# Altium schematic sheet 5F00143A MPLB-01.SchDoc
size 420 x 297 mm; Author: ALTIUM GOSTBOM2.0 KEV
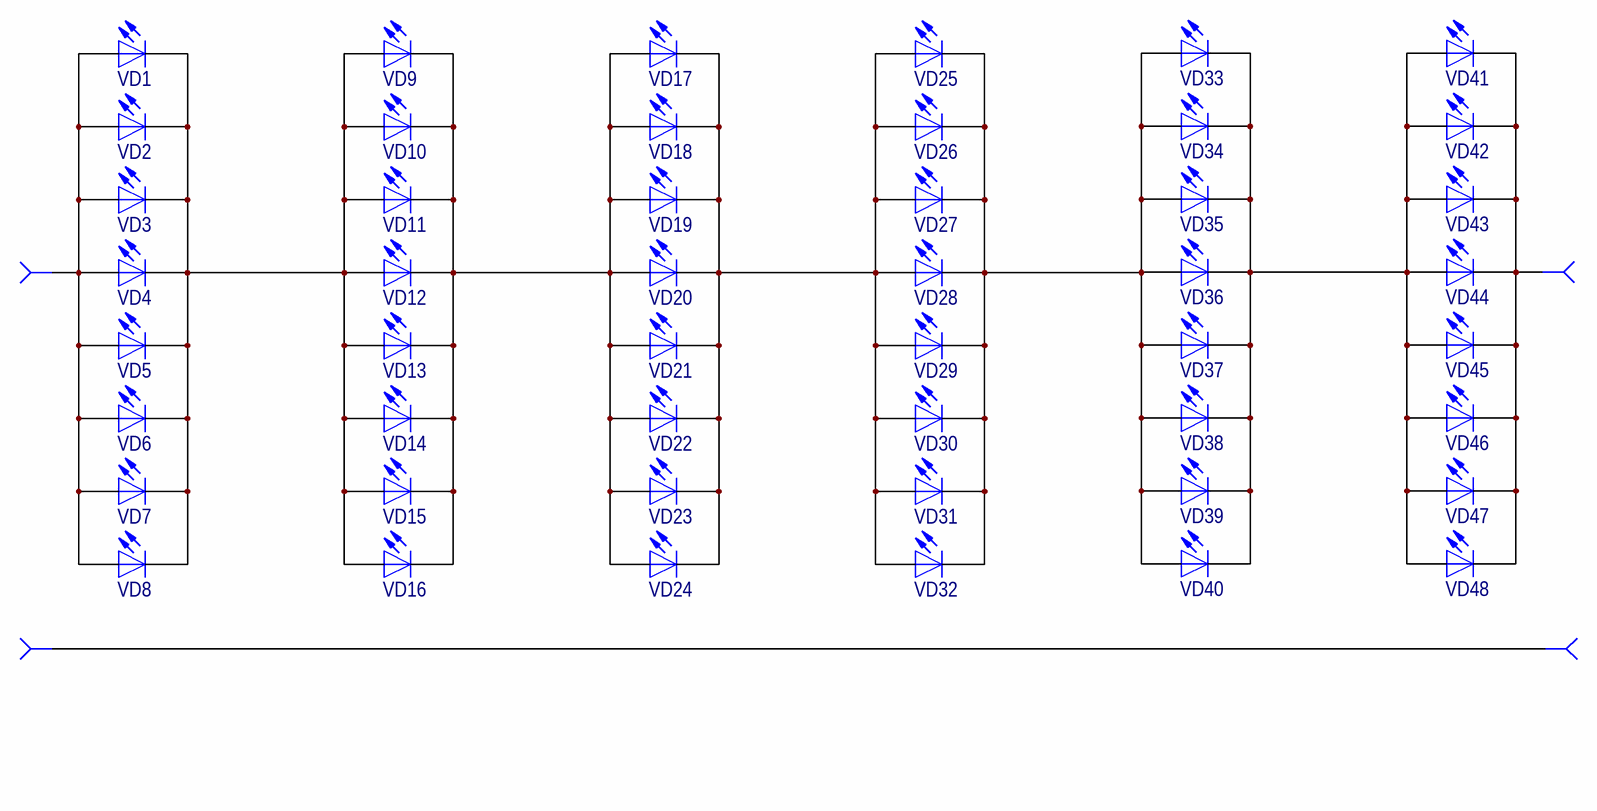
[diagram p0: 5F00143A MPLB-01.SchDoc]

## Parts
VD1  LED SMD, SPMWH1228FD5WAWMSG, White, 2700K,  Samsung  [LM281B+]  (value not drawn)
VD2  LED SMD, SPMWH1228FD5WAWMSG, White, 2700K,  Samsung  [LM281B+]  (value not drawn)
VD3  LED SMD, SPMWH1228FD5WAWMSG, White, 2700K,  Samsung  [LM281B+]  (value not drawn)
VD4  LED SMD, SPMWH1228FD5WAWMSG, White, 2700K,  Samsung  [LM281B+]  (value not drawn)
VD5  LED SMD, SPMWH1228FD5WAWMSG, White, 2700K,  Samsung  [LM281B+]  (value not drawn)
VD6  LED SMD, SPMWH1228FD5WAWMSG, White, 2700K,  Samsung  [LM281B+]  (value not drawn)
VD7  LED SMD, SPMWH1228FD5WAWMSG, White, 2700K,  Samsung  [LM281B+]  (value not drawn)
VD8  LED SMD, SPMWH1228FD5WAWMSG, White, 2700K,  Samsung  [LM281B+]  (value not drawn)
VD9  LED SMD, SPMWH1228FD5WAWMSG, White, 2700K,  Samsung  [LM281B+]  (value not drawn)
VD10  LED SMD, SPMWH1228FD5WAWMSG, White, 2700K,  Samsung  [LM281B+]  (value not drawn)
VD11  LED SMD, SPMWH1228FD5WAWMSG, White, 2700K,  Samsung  [LM281B+]  (value not drawn)
VD12  LED SMD, SPMWH1228FD5WAWMSG, White, 2700K,  Samsung  [LM281B+]  (value not drawn)
VD13  LED SMD, SPMWH1228FD5WAWMSG, White, 2700K,  Samsung  [LM281B+]  (value not drawn)
VD14  LED SMD, SPMWH1228FD5WAWMSG, White, 2700K,  Samsung  [LM281B+]  (value not drawn)
VD15  LED SMD, SPMWH1228FD5WAWMSG, White, 2700K,  Samsung  [LM281B+]  (value not drawn)
VD16  LED SMD, SPMWH1228FD5WAWMSG, White, 2700K,  Samsung  [LM281B+]  (value not drawn)
VD17  LED SMD, SPMWH1228FD5WAWMSG, White, 2700K,  Samsung  [LM281B+]  (value not drawn)
VD18  LED SMD, SPMWH1228FD5WAWMSG, White, 2700K,  Samsung  [LM281B+]  (value not drawn)
VD19  LED SMD, SPMWH1228FD5WAWMSG, White, 2700K,  Samsung  [LM281B+]  (value not drawn)
VD20  LED SMD, SPMWH1228FD5WAWMSG, White, 2700K,  Samsung  [LM281B+]  (value not drawn)
VD21  LED SMD, SPMWH1228FD5WAWMSG, White, 2700K,  Samsung  [LM281B+]  (value not drawn)
VD22  LED SMD, SPMWH1228FD5WAWMSG, White, 2700K,  Samsung  [LM281B+]  (value not drawn)
VD23  LED SMD, SPMWH1228FD5WAWMSG, White, 2700K,  Samsung  [LM281B+]  (value not drawn)
VD24  LED SMD, SPMWH1228FD5WAWMSG, White, 2700K,  Samsung  [LM281B+]  (value not drawn)
VD25  LED SMD, SPMWH1228FD5WAWMSG, White, 2700K,  Samsung  [LM281B+]  (value not drawn)
VD26  LED SMD, SPMWH1228FD5WAWMSG, White, 2700K,  Samsung  [LM281B+]  (value not drawn)
VD27  LED SMD, SPMWH1228FD5WAWMSG, White, 2700K,  Samsung  [LM281B+]  (value not drawn)
VD28  LED SMD, SPMWH1228FD5WAWMSG, White, 2700K,  Samsung  [LM281B+]  (value not drawn)
VD29  LED SMD, SPMWH1228FD5WAWMSG, White, 2700K,  Samsung  [LM281B+]  (value not drawn)
VD30  LED SMD, SPMWH1228FD5WAWMSG, White, 2700K,  Samsung  [LM281B+]  (value not drawn)
VD31  LED SMD, SPMWH1228FD5WAWMSG, White, 2700K,  Samsung  [LM281B+]  (value not drawn)
VD32  LED SMD, SPMWH1228FD5WAWMSG, White, 2700K,  Samsung  [LM281B+]  (value not drawn)
VD33  LED SMD, SPMWH1228FD5WAWMSG, White, 2700K,  Samsung  [LM281B+]  (value not drawn)
VD34  LED SMD, SPMWH1228FD5WAWMSG, White, 2700K,  Samsung  [LM281B+]  (value not drawn)
VD35  LED SMD, SPMWH1228FD5WAWMSG, White, 2700K,  Samsung  [LM281B+]  (value not drawn)
VD36  LED SMD, SPMWH1228FD5WAWMSG, White, 2700K,  Samsung  [LM281B+]  (value not drawn)
VD37  LED SMD, SPMWH1228FD5WAWMSG, White, 2700K,  Samsung  [LM281B+]  (value not drawn)
VD38  LED SMD, SPMWH1228FD5WAWMSG, White, 2700K,  Samsung  [LM281B+]  (value not drawn)
VD39  LED SMD, SPMWH1228FD5WAWMSG, White, 2700K,  Samsung  [LM281B+]  (value not drawn)
VD40  LED SMD, SPMWH1228FD5WAWMSG, White, 2700K,  Samsung  [LM281B+]  (value not drawn)
VD41  LED SMD, SPMWH1228FD5WAWMSG, White, 2700K,  Samsung  [LM281B+]  (value not drawn)
VD42  LED SMD, SPMWH1228FD5WAWMSG, White, 2700K,  Samsung  [LM281B+]  (value not drawn)
VD43  LED SMD, SPMWH1228FD5WAWMSG, White, 2700K,  Samsung  [LM281B+]  (value not drawn)
VD44  LED SMD, SPMWH1228FD5WAWMSG, White, 2700K,  Samsung  [LM281B+]  (value not drawn)
VD45  LED SMD, SPMWH1228FD5WAWMSG, White, 2700K,  Samsung  [LM281B+]  (value not drawn)
VD46  LED SMD, SPMWH1228FD5WAWMSG, White, 2700K,  Samsung  [LM281B+]  (value not drawn)
VD47  LED SMD, SPMWH1228FD5WAWMSG, White, 2700K,  Samsung  [LM281B+]  (value not drawn)
VD48  LED SMD, SPMWH1228FD5WAWMSG, White, 2700K,  Samsung  [LM281B+]  (value not drawn)
XS1  Single Horizontal Contact 709296001004006, SMD, AWG20~AWG12, AVX  [70-9296-001-004-006]  (value not drawn)  (no BOM)
XS2  Single Horizontal Contact 709296001004006, SMD, AWG20~AWG12, AVX  [70-9296-001-004-006]  (value not drawn)  (no BOM)
XS3  Single Horizontal Contact 709296001004006, SMD, AWG20~AWG12, AVX  [70-9296-001-004-006]  (value not drawn)  (no BOM)
XS4  Single Horizontal Contact 709296001004006, SMD, AWG20~AWG12, AVX  [70-9296-001-004-006]  (value not drawn)  (no BOM)

## Nets
NetVD1_1: VD1.1(K) VD2.1(K) VD3.1(K) VD4.1(K) VD5.1(K) VD6.1(K) VD7.1(K) VD8.1(K) VD9.2(A) VD10.2(A) VD11.2(A) VD12.2(A) VD13.2(A) VD14.2(A) VD15.2(A) VD16.2(A)
NetVD1_2: VD1.2(A) VD2.2(A) VD3.2(A) VD4.2(A) VD5.2(A) VD6.2(A) VD7.2(A) VD8.2(A) XS1.1
NetVD9_1: VD9.1(K) VD10.1(K) VD11.1(K) VD12.1(K) VD13.1(K) VD14.1(K) VD15.1(K) VD16.1(K) VD17.2(A) VD18.2(A) VD19.2(A) VD20.2(A) VD21.2(A) VD22.2(A) VD23.2(A) VD24.2(A)
NetVD17_1: VD17.1(K) VD18.1(K) VD19.1(K) VD20.1(K) VD21.1(K) VD22.1(K) VD23.1(K) VD24.1(K) VD25.2(A) VD26.2(A) VD27.2(A) VD28.2(A) VD29.2(A) VD30.2(A) VD31.2(A) VD32.2(A)
NetVD25_1: VD25.1(K) VD26.1(K) VD27.1(K) VD28.1(K) VD29.1(K) VD30.1(K) VD31.1(K) VD32.1(K) VD33.2(A) VD34.2(A) VD35.2(A) VD36.2(A) VD37.2(A) VD38.2(A) VD39.2(A) VD40.2(A)
NetVD33_1: VD33.1(K) VD34.1(K) VD35.1(K) VD36.1(K) VD37.1(K) VD38.1(K) VD39.1(K) VD40.1(K) VD41.2(A) VD42.2(A) VD43.2(A) VD44.2(A) VD45.2(A) VD46.2(A) VD47.2(A) VD48.2(A)
NetVD41_1: VD41.1(K) VD42.1(K) VD43.1(K) VD44.1(K) VD45.1(K) VD46.1(K) VD47.1(K) VD48.1(K) XS3.1
NetXS2_1: XS2.1 XS4.1

## Notes on the sheet
- Prim. application
- Reference №
- Sign. and date
- Inv. № backup.
- Instead. inv. №
- Rev.
- Designed
- Sheet
- Document №
- Signature
- Date
- Letter
- Mass
- Scale
- Checked
- T.contr.
- Sheets
- Inv. № original
- Inspector
- Approved
- ALTIUM GOSTBOM2.0 KEV
- File:
- Date:
- Copy
- Size A3

## Library data of the parts
VD1-VD48 = 4278: LLED SMD, SPMWH1228FD5WAWMSG, White, 2700K,  Samsung; Value: LM281B+; idComponent: 4278; Jofre_PN: HL00050; Component_Group: Diodes; Operating_Temperature: -40...+80°C; Notes: price KVV; User: Busliuk@ke-bav; Component_Type: LED; Package: 1113 (2835 Metric); Mounting_Type: SMD; Manufacturer: Samsung; Manufacturer_PN: SPMWH1228FD5WAWMSG; ComponentLink1Description: Datasheet; Price_EUR: 0,14; Status: Unchecked; Date_of_Update: 30.07.2019 11:32:19; Date_of_Creation: 30.07.2019 11:32:19
XS1-XS4 = 110: Single Horizontal Contact 709296001004006, SMD, AWG20~AWG12, AVX, 4mm, 300V, Dinsul=3,4mm, UL, 1pin; idComponent: 110; Component_Group: Connectors; Operating_Temperature: -40...125°C; Notes: Price Digikey @ 2000pcs.; User: Busliuk@localhost; Value: 709296001004006; NetName: *; Jofre_PN: -; Component_Type: Connectors; Package: 11.0mm x 4.0mm x 4.0mm; Mounting_Type: SMD; Marking_Code: -; Manufacturer: AVX; Manufacturer_PN: 709296001004006; ComponentLink1Description: Datasheet; ComponentLink1URL: L:/_TempLibrary/AltiumComponents/Datasheets/Poke_Home_Single_70-9296.pdf; Price_EUR: 0,1699; Status: Unchecked; Date_of_Update: 09.10.2018 12:19:34; Date_of_Creation: 26.03.2018 11:04:42